# EasyEDA schematic Rev2 Schematic.json
TITLE: E45 Vibration Bracelet Final Schematic; REV: 1.1; Date: 2019-03-21; Sheet: 1/1; Drawn By: Team E45; Company: Marquette University
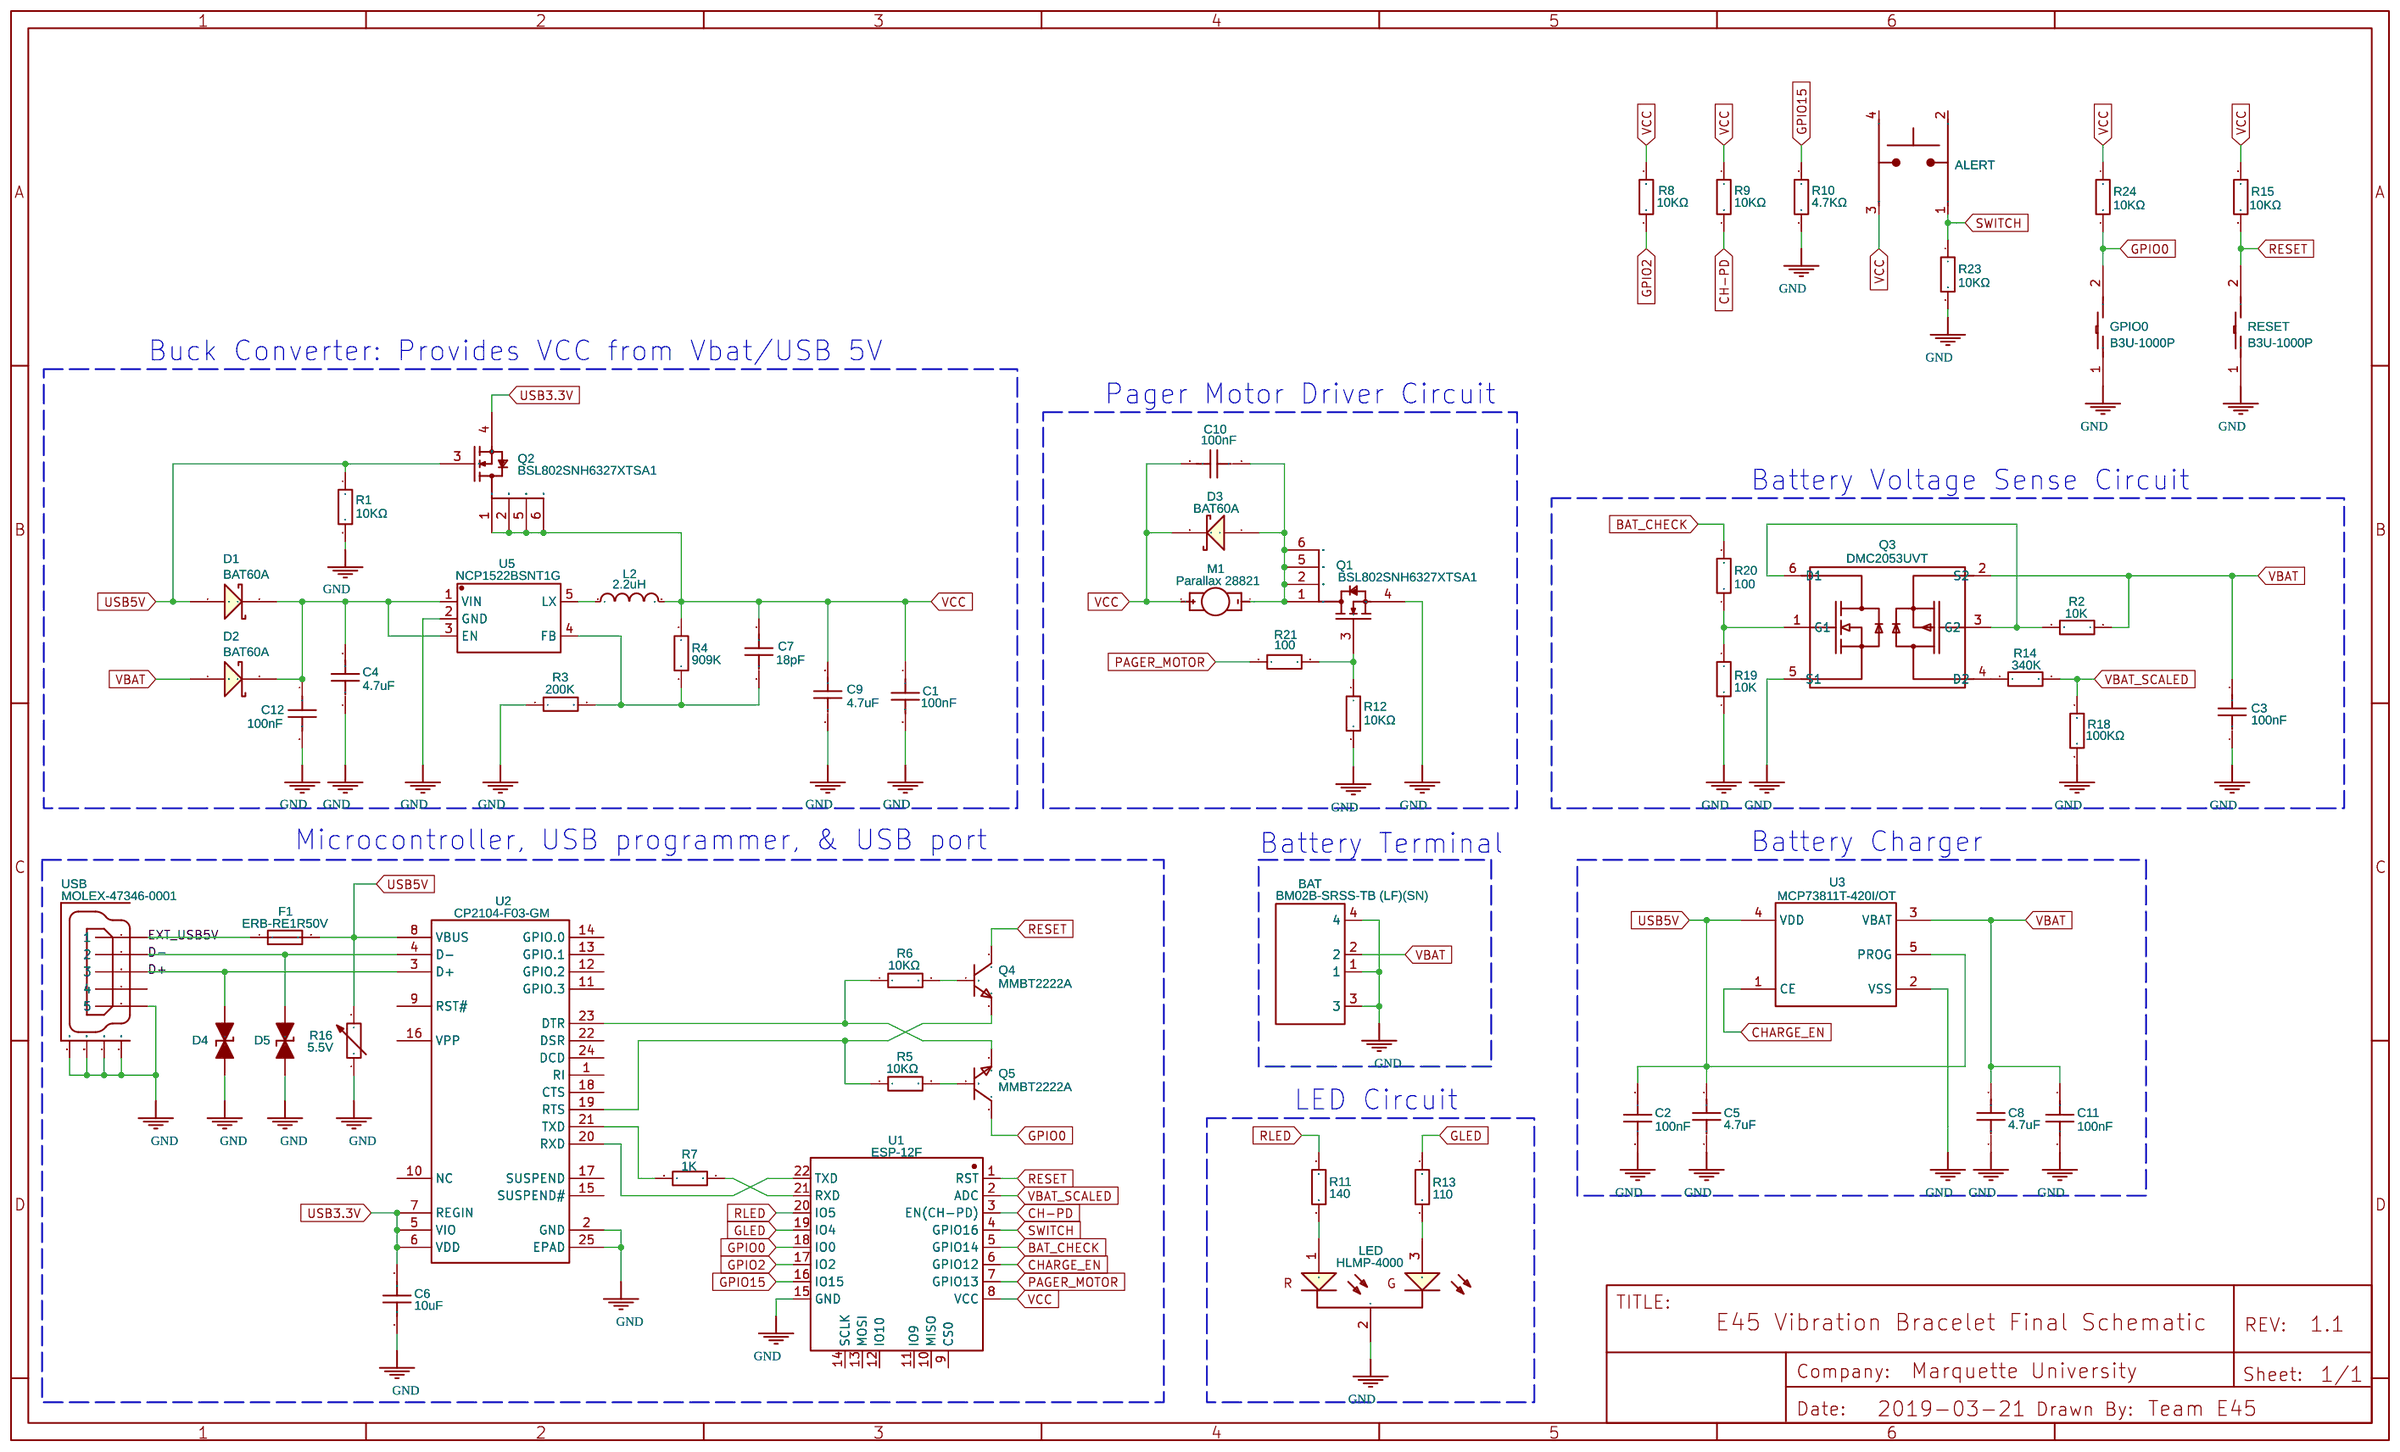
[diagram p0: schematic sheet]

## Parts
ALERT  Pushbutton_SMD_SPST_2x2  [PUSHBUTTON_SMD_11.2X5.9]
BAT  BM02B-SRSS-TB (LF)(SN)  [BM02B-SRSS-TB (LF)(SN)]
C1  100nF  [0402]
C2  100nF  [0402]
C3  100nF  [0402]
C4  4.7uF  [0402]
C5  4.7uF  [0402]
C6  10uF  [0603]
C7  18pF  [0402]
C8  4.7uF  [0402]
C9  4.7uF  [0402]
C10  100nF  [0402]
C11  100nF  [0402]
C12  100nF  [0402]
D1  BAT60A  [SOD-323]
D2  BAT60A  [SOD-323]
D3  BAT60A  [SOD-323]
D4  PGB1010402KR  [0402]
D5  PGB1010402KR  [0402]
F1  ERB-RE1R50V  [0603]
GPIO0  B3U-1000P  [B3U-1000PM]
L2  2.2uH  [SMD-L-2.5X2.0X1.0]
LED  HLMP-4000  [HLMP-4000]
M1  Parallax 28821  [VIBE-MOTOR-10MM]
Q1  BSL802SNH6327XTSA1  [TSOP-6]
Q2  BSL802SNH6327XTSA1  [TSOP-6]
Q3  DMC2053UVT  [TSOT6]
Q4  MMBT2222A  [SOT-23(SOT-23-3)]
Q5  MMBT2222A  [SOT-23(SOT-23-3)]
R1  10KΩ  [0402]
R2  10K  [0402]
R3  200K  [0402]
R4  909K  [0402]
R5  10KΩ  [0402]
R6  10KΩ  [0402]
R7  1K  [0402]
R8  10KΩ  [0402]
R9  10KΩ  [0402]
R10  4.7KΩ  [0402]
R11  140  [0402]
R12  10KΩ  [0402]
R13  110  [0402]
R14  340K  [0402]
R15  10KΩ  [0402]
R16  5.5V  [0603]
R18  100KΩ  [0402]
R19  10K  [0402]
R20  100  [0402]
R21  100  [0402]
R23  10KΩ  [0402]
R24  10KΩ  [0402]
RESET  B3U-1000P  [B3U-1000PM]
U1  ESP-12F  [ESP-12F(ESP8266MOD)]
U2  CP2104-F03-GM  [QFN-24_4X4X05P]
U3  MCP73811T-420I/OT  [SOT-23-5]
U5  NCP1522BSNT1G  [TSOP-5]
USB  MOLEX-47346-0001  [MOLEX-47364-0001]

## Library data of the parts
ALERT = -: Manufacturer Part: LL3301NF065QG; Supplier: Mouser; Supplier Part: 612-LL3301NF065QG; link: https://www.mouser.com/datasheet/2/140/P090002-267756.pdf; Contributor: ShawnSatCOR
BAT = -: Supplier: Digi-Key; Supplier Part: 455-1788-1-ND; Manufacturer: JST Sales America; Manufacturer Part: BM02B-SRSS-TB(LF)(SN); Contributor: LCSC
C1-C3 C10-C12 = -: Manufacturer Part: 0402YC104KAT2A; Supplier: Mouser; Supplier Part: 581-0402YC104KAT2A; link: https://www.mouser.com/ProductDetail/AVX/0402YC104KAT2A?qs=sGAEpiMZZMvsSlwiRhF8qquPIBdUMwzgGmxk%252BiLHu4U%3D; Contributor: wheetcracker
C4 C5 C8 C9 = -: Manufacturer Part: CC0402MRX5R7BB475; Supplier: Mouser; Supplier Part: 603-CC0402MRX57BB475; link: https://www.mouser.com/ProductDetail/Yageo/CC0402MRX5R7BB475?qs=UgE%2F0m3bTsZK9CNJNtIlOQ%3D%3D; Contributor: wheetcracker
C6 = EMK107BBJ106MA-T: Supplier: Mouser; Manufacturer: TAIYO YUDEN; Supplier Part: C90058
C7 = -: Manufacturer Part: C0402C180M5HACTU; Supplier: Mouser; Supplier Part: 80-C0402C180M5HACTU; link: https://www.mouser.com/ProductDetail/KEMET/C0402C180M5HACTU?qs=sGAEpiMZZMvsSlwiRhF8qtsBU8Zhqm2RAtanxJBRsIbPE1ZK%252BE1k8Q%3D%3D; Contributor: wheetcracker
D1-D3 = -: Silicon AF Schottky Rectifier Diode with Extreme Low VF Drop; Manufacturer Part: ?; Supplier: Mouser
D4 D5 = -: Supplier: Mouser; Manufacturer: Littelfuse; image: //image.lceda.cn/szlcsc/C10676.jpg; Supplier Part: C10676
F1 = -: Supplier: Mouser; Supplier Part: 667-ERB-RE1R50V; link: https://www.mouser.com/ProductDetail/Panasonic/ERB-RE1R50V?qs=sGAEpiMZZMtxU2g%2F1juGqa87XT83sxJK3nfgH66gLJw%3D; Contributor: wheetcracker
GPIO0 RESET = -: Supplier: Mouser; Supplier Part: C231329; Manufacturer: Omron Electronics; Contributor: LCSC
L2 = VLS252015ET-2R2M: Supplier: Mouser; Manufacturer: TDK; Contributor: LCSC; Supplier Part: C136232
LED = -: Standard LEDs - Through Hole Green/Red Diffused 568/635nm 2.1mcd; Supplier: Mouser; Supplier Part: 630-HLMP-4000; link: https://www.mouser.com/ProductDetail/Broadcom-Avago/HLMP-4000?qs=sGAEpiMZZMtilyJihmhKq3G3Ygy4E3aBv%2FfHpu9wusU%3D; Contributor: wheetcracker
M1 = -: Contributor: SparkFun; Manufacturer Part: 28821; Supplier: Digi-Key; Supplier Part: 28821-ND; Manufacturer: Parallax
Q1 Q2 = -: Supplier: Mouser; Supplier Part: 726-BSL802SNH6327XTS; link: https://www.mouser.com/ProductDetail/Infineon-Technologies/BSL802SNH6327XTSA1?qs=3%2FhYFTG7CVdrl%252BzdA2k5kA%3D%3D; Contributor: wheetcracker
Q3 = -: Supplier: Mouser; Supplier Part: 621-DMC2053UVT-7; link: https://www.mouser.com/ProductDetail/Diodes-Incorporated/DMC2053UVT-7?qs=sGAEpiMZZMshyDBzk1%2FWi%2FD7Em5shE8q9nq1bWCkc5k1qCyJC0fzTw%3D%3D; Contributor: wheetcracker
Q4 Q5 = -: Supplier Part: MMBT2222AWT3GOSCT-ND; Supplier: Digi-Key; Manufacturer: ON Semiconductor; Manufacturer Part: MMBT2222AWT3G; Contributor: LCSC
R1 R2 R5 R6 R8 R9 R12 R15 R19 R23 R24 = RM04FTN1002: Supplier: Mouser; Manufacturer: TA-I; Supplier Part: C153110
R3 = AR02BTD2003: Supplier: Mouser; Supplier Part: C319777; Manufacturer: Viking Tech; Contributor: LCSC
R4 = AC0402FR-07909KL: Supplier: Mouser; Supplier Part: C227267; Manufacturer: YAGEO; Contributor: LCSC
R7 = ERJ-2RKF1001X: Supplier: Mouser; Supplier Part: C192168; Manufacturer: PANASONIC; Contributor: LCSC
R10 = RS-02K4701FT: Supplier: Mouser; Manufacturer: FH; Supplier Part: C140158
R11 = AC0402FR-07140RL: Supplier: Mouser; Supplier Part: C226782; Manufacturer: YAGEO; Contributor: LCSC
R13 = RC0402FR-07110RL: Supplier: Mouser; Manufacturer: YAGEO; Supplier Part: C138064
R14 = AC0402FR-07340KL: Supplier: Mouser; Supplier Part: C227001; Manufacturer: YAGEO; Contributor: LCSC
R16 = V5.5MLA0603LNR: Supplier: Mouser; Manufacturer: Littelfuse; Supplier Part: C126845
R18 = 0402WGF1003TCE: Supplier: Mouser; Manufacturer: UniOhm; LCSC Assembly: Yes; Supplier Part: C25741
R20 R21 = RN73H1ETTP1000B25: Supplier: Mouser; Supplier Part: C186113; Manufacturer: KOA Speer Elec; Contributor: LCSC
U1 = -: Supplier: Amazon; Manufacturer: Ai-Thinker; Supplier Part: B01M4IOFIT
U2 = -: Supplier: Mouser; Manufacturer: SILICON LABS; LCSC Assembly: Yes; image: //image.lceda.cn/szlcsc/C47742.jpg; Supplier Part: C47742
U3 = -: Supplier: Mouser; Manufacturer: MICROCHIP; Contributor: LCSC; Supplier Part: C145381
U5 = -: Supplier: Mouser; Supplier Part: C231821; Manufacturer: ON Semicon; Contributor: LCSC
USB = -: Manufacturer Part: ?; Supplier: Mouser

## Nets
GND: BAT.1 BAT.3 BAT.4 C1.2 C2.2 C3.1 C4.1 C5.1 C6.1 C8.1 C9.1 C11.2 C12.2 D4.2(A) D5.2(A) GPIO0.1 LED.2(B) Q1.4(Source) Q3.5(S1) R1.2 R3.1 R10.1 R12.2 R16.1 R18.2 R19.1 R23.2 RESET.1 U1.15(GND) U2.2(GND) U2.25(EPAD) U3.2(VSS) U5.2(GND) USB.5 USB.GND1 USB.GND2 USB.GND3 USB.GND4
VBAT: BAT.2 C3.2 C8.2 C11.1 D2.1(A) Q3.2(S2) R2.1 U3.3(VBAT)
VBAT_SCALED: R14.2 R18.1 U1.2(ADC)
VCC: ALERT.3 C1.1 C7.2 C9.2 C10.2 D3.2(K) L2.2 M1.+ Q2.1(Drain) Q2.2(Drain) Q2.5(Drain) Q2.6(Drain) R4.2 R8.1 R9.1 R15.1 R24.1 U1.8(VCC)
BAT_CHECK: R20.2 U1.5(GPIO14)
CH-PD: R9.2 U1.3(EN(CH-PD))
CHARGE_EN: U1.6(GPIO12) U3.1(CE)
D+: D4.1(K) U2.3(D+) USB.3
D-: D5.1(K) U2.4(D-) USB.2
EXT_USB5V: F1.1 USB.1
GLED: R13.2 U1.19(IO4)
GPIO0: GPIO0.2 Q5.3(C) R24.2 U1.18(IO0)
GPIO2: R8.2 U1.17(IO2)
GPIO15: R10.2 U1.16(IO15)
PAGER_MOTOR: R21.1 U1.7(GPIO13)
RESET: Q4.3(C) R15.2 RESET.2 U1.1(RST)
RLED: R11.2 U1.20(IO5)
SWITCH: ALERT.1 R23.1 U1.4(GPIO16)
USB3.3V: C6.2 Q2.4(Source) U2.5(VIO) U2.6(VDD) U2.7(REGIN)
USB5V: C2.1 C5.2 D1.1(A) F1.2 Q2.3(Gate) R1.1 R16.2 U2.8(VBUS) U3.4(VDD) U3.5(PROG)
LED_1: LED.1(A) R11.1
LED_3: LED.3(C) R13.1
M1_-: C10.1 D3.1(A) M1.- Q1.1(Drain) Q1.2(Drain) Q1.5(Drain) Q1.6(Drain)
Q3_1: Q3.1(G1) R19.2 R20.1
Q3_3: Q3.3(G2) Q3.6(D1) R2.2
Q3_4: Q3.4(D2) R14.1
Q4_1: Q4.1(B) R6.2
Q5_1: Q5.1(B) R5.2
R12_1: Q1.3(Gate) R12.1 R21.2
U1_21: R7.2 U1.21(RXD)
U2_19: Q4.2(E) R5.1 U2.19(RTS)
U2_20: U1.22(TXD) U2.20(RXD)
U2_21: R7.1 U2.21(TXD)
U2_23: Q5.2(E) R6.1 U2.23(DTR)
U5_1: C4.2 C12.1 D1.2(K) D2.2(K) U5.1(VIN) U5.3(EN)
U5_4: C7.1 R3.2 R4.1 U5.4(FB)
U5_5: L2.1 U5.5(LX)

Not connected (* = marked no-connect by the designer): ALERT 2 4; U1 9(CS0) 10(MISO) 11(IO9) 12(IO10) 13(MOSI) 14(SCLK); U2 1(RI) 9(RST#) 10(NC) 11(GPIO.3) 12(GPIO.2) 13(GPIO.1) 14(GPIO.0) 15(SUSPEND#) 16(VPP) 17(SUSPEND) 18(CTS) 22(DSR) 24(DCD); USB 4

## Notes on the sheet
- Buck Converter: Provides VCC from Vbat/USB 5V
- Pager Motor Driver Circuit
- Battery Voltage Sense Circuit
- Microcontroller, USB programmer, & USB port
- Battery Terminal
- Battery Charger
- LED Circuit
